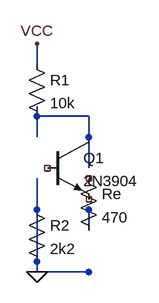
[diagram p0: schematic common_emitter.asc]
common_emitter.asc, the LTspice schematic file:
Version 4
SHEET 1 880 680
WIRE 224 64 224 32
WIRE 224 144 224 128
WIRE 304 144 224 144
WIRE 224 176 224 144
WIRE 304 224 304 144
WIRE 224 288 224 240
WIRE 304 288 304 288
WIRE 304 320 304 288
WIRE 224 352 224 288
WIRE 224 384 224 352
WIRE 304 384 304 384
WIRE 304 384 224 384
FLAG 224 32 VCC
FLAG 224 384 0
SYMBOL res 208 48 R0
SYMATTR InstName R1
SYMATTR Value 10k
SYMBOL res 208 272 R0
SYMATTR InstName R2
SYMATTR Value 2k2
SYMBOL npn 240 176 R0
SYMATTR InstName Q1
SYMATTR Value 2N3904
SYMBOL res 288 224 R0
SYMATTR InstName Re
SYMATTR Value 470

The netlist it stands for:
* common_emitter.asc
R1 VCC N001 10k
R2 0 0 2k2
* Q1: 2N3904 (symbol npn not certain, pin order unknown); nets seen at it: 0, N001
Re NC_03 N002 470
.backanno
.end